# EAGLE schematic Wheatstone (EAGLE 9.6.2)
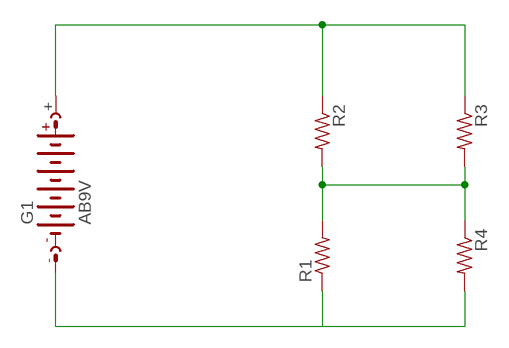
[diagram p0: schematic, sheet 1]

## Parts
G1  AB9V  [AB9V]
R1  R-US_R0805  [R0805]
R2  R-US_R0805  [R0805]
R3  R-US_R0805  [R0805]
R4  R-US_R0805  [R0805]

## Nets
N$1: G1.+ R2.1 R3.1
N$2: R1.2 R2.2 R3.2 R4.1
N$3: G1.- R1.1 R4.2

## Library data of the parts
G1 = battery:AB9V: 9-V BATTERY CLIP
R1-R4 = rcl:R-US_: RESISTOR, American symbol; SPICEPREFIX: R